# EasyEDA Pro project ProPrj_BL0910+ESP8266十路小体积电能表_2024-10-20_14-27-09_2024-11-02.epro

# Schematic BL0910+ESP8266十路小体积电能表
Board Name: BL0910+ESP8266十路小体积电能表; Create Date: 2024-10-20; Page Name: Sheet_1; Project Name: BL0910+ESP8266十路小体积电能表_2024-10-20_14-27-09; Schematic Name: BL0910+ESP8266十路小体积电能表; Update Date: 2024-10-31; Add into BOM: yes; Company: Your Company; Convert to PCB: yes; Date: 2024-10-16; Draw By: mxmcxy; REV: 1.0; Sheet: 1/1
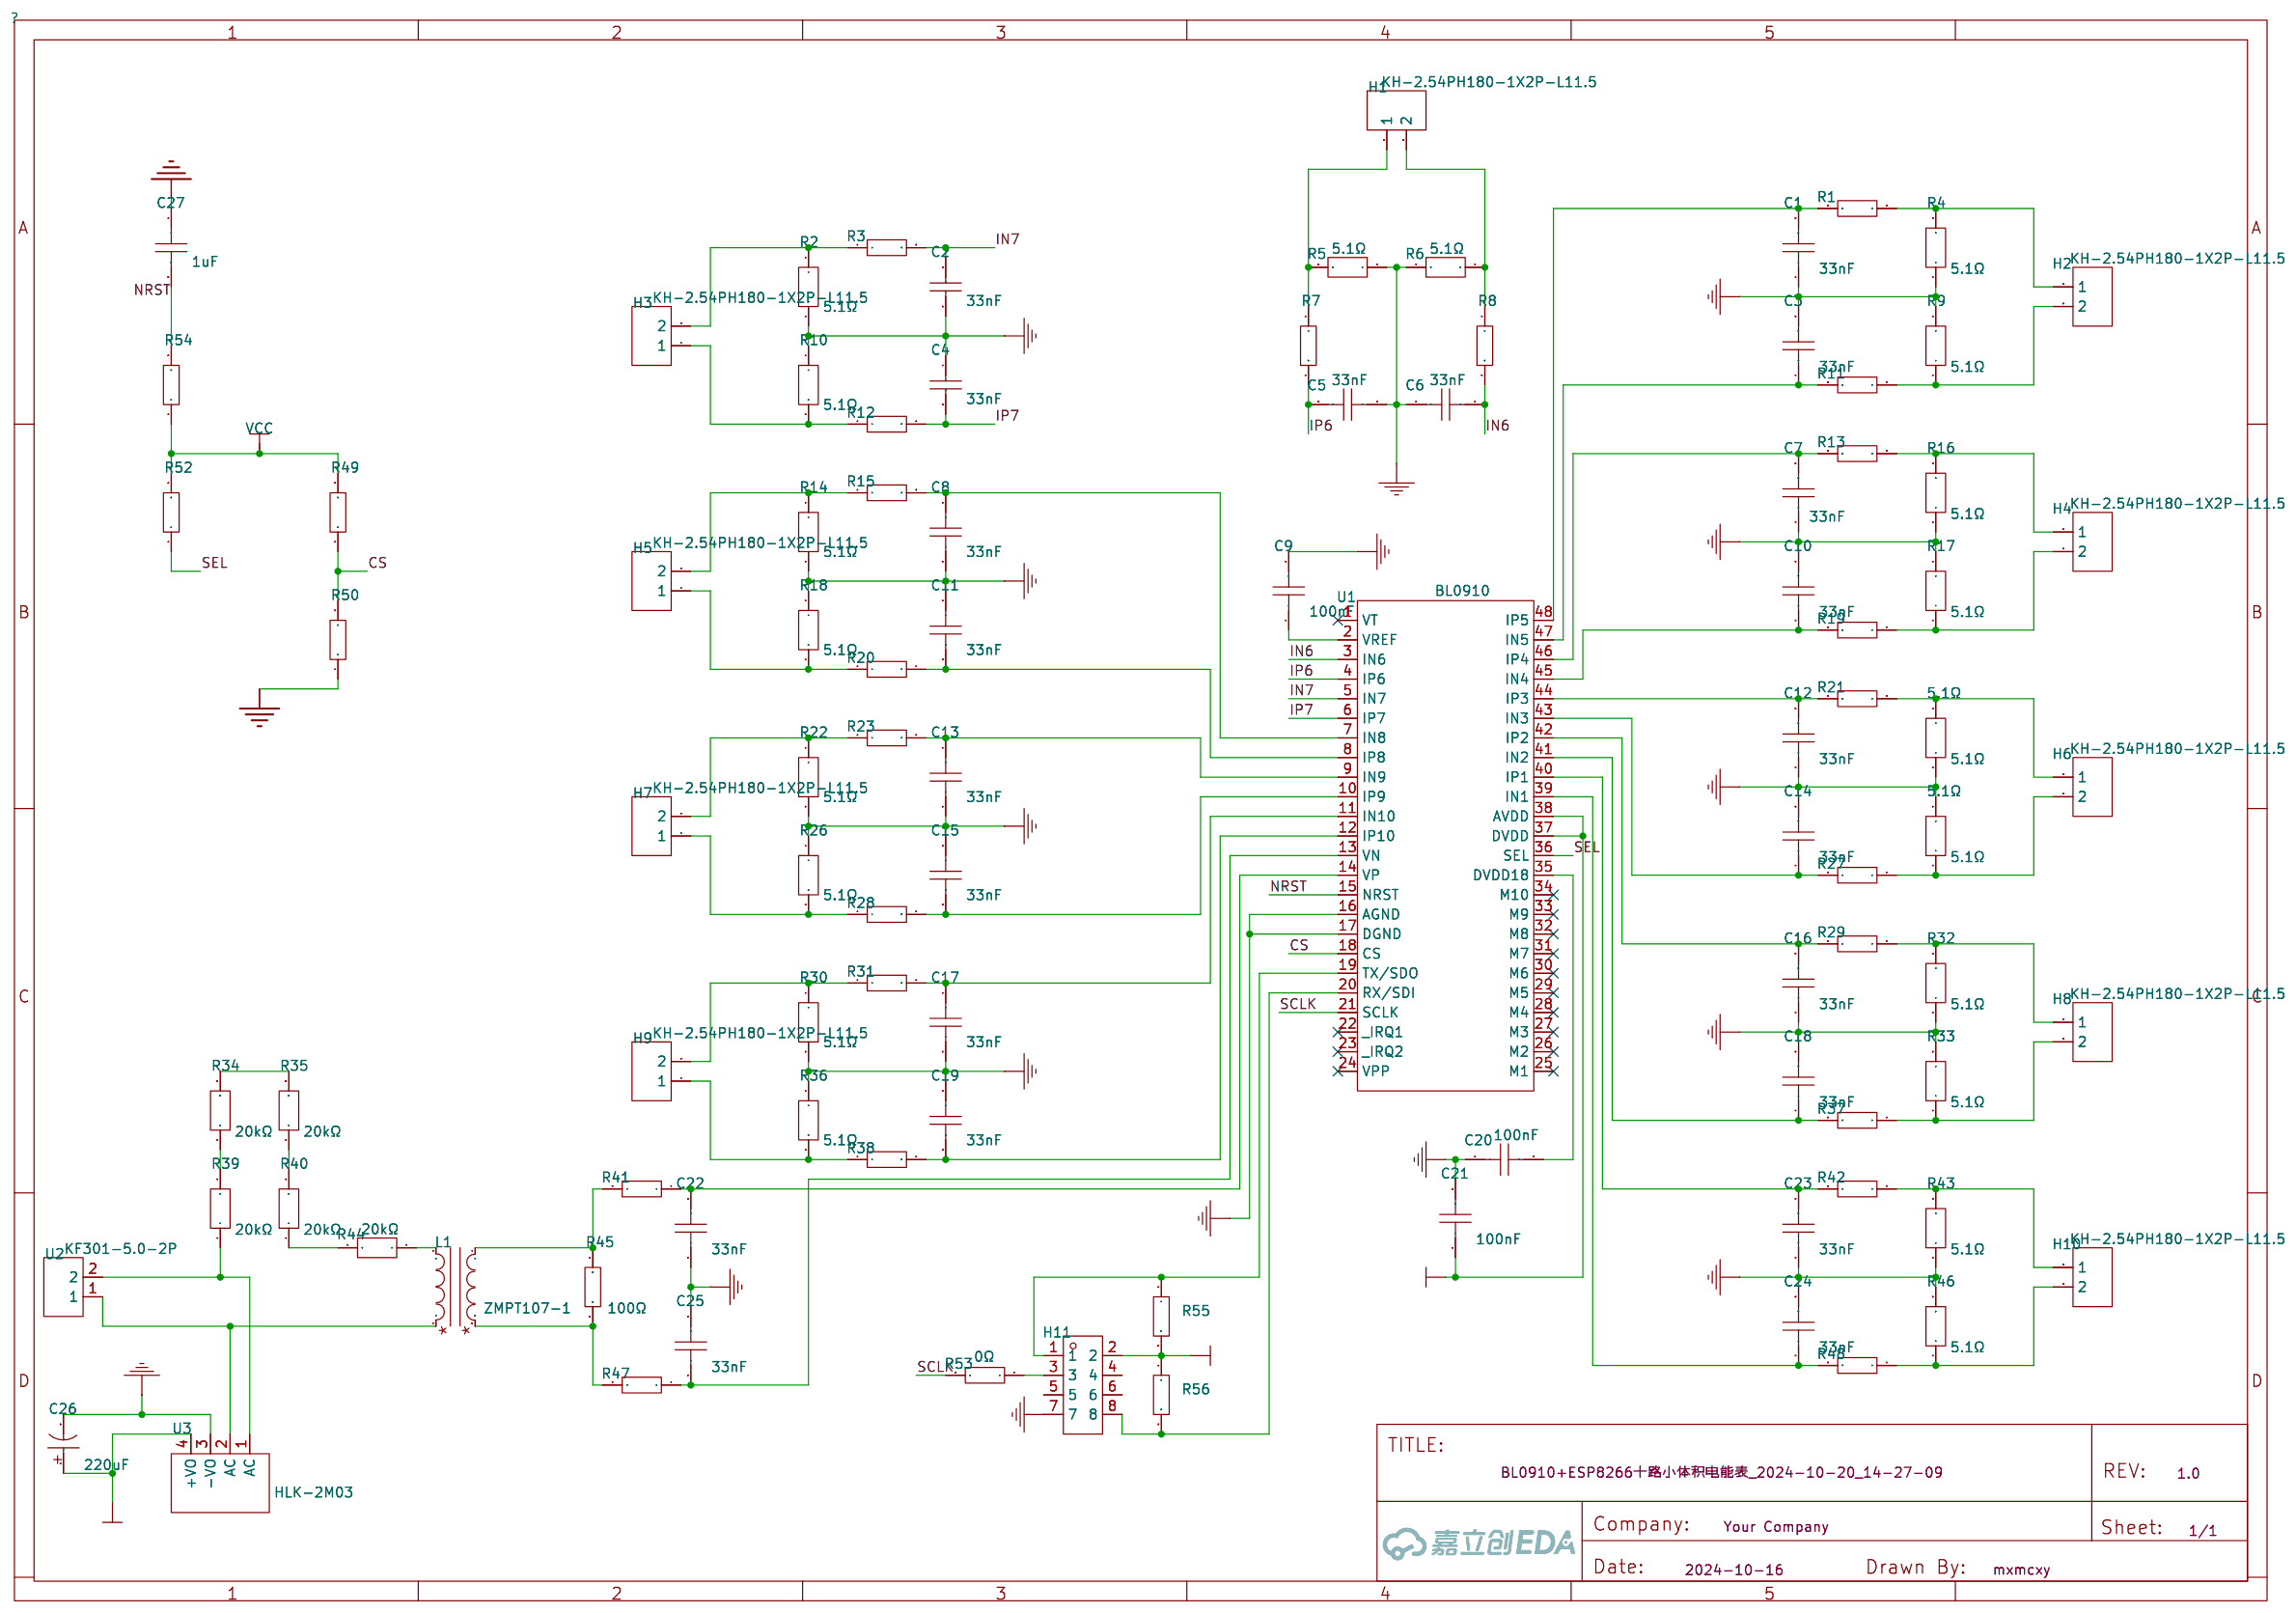
[diagram p0: schematic sheet]

## Parts
5.1Ω  5.1Ω  [R0603]
5.1Ω#2  5.1Ω  [R0603]
C1  33nF  [C0603]
C2  33nF  [C0603]
C3  33nF  [C0603]
C4  33nF  [C0603]
C5  33nF  [C0603]
C6  33nF  [C0603]
C7  33nF  [C0603]
C8  33nF  [C0603]
C9  100nF  [C0603]
C10  33nF  [C0603]
C11  33nF  [C0603]
C12  33nF  [C0603]
C13  33nF  [C0603]
C14  33nF  [C0603]
C15  33nF  [C0603]
C16  33nF  [C0603]
C17  33nF  [C0603]
C18  33nF  [C0603]
C19  33nF  [C0603]
C20  100nF  [C0603]
C21  100nF  [C0603]
C22  33nF  [C0603]
C23  33nF  [C0603]
C24  33nF  [C0603]
C25  33nF  [C0603]
C26  220uF  [CAP-SMD_BD6.3-L6.6-W6.6-FD]
C27  1uF  [C0603]
H1  KH-2.54PH180-1X2P-L11.5  [HDR-TH_2P-P2.54-V-M]
H2  KH-2.54PH180-1X2P-L11.5  [HDR-TH_2P-P2.54-V-M]
H3  KH-2.54PH180-1X2P-L11.5  [HDR-TH_2P-P2.54-V-M]
H4  KH-2.54PH180-1X2P-L11.5  [HDR-TH_2P-P2.54-V-M]
H5  KH-2.54PH180-1X2P-L11.5  [HDR-TH_2P-P2.54-V-M]
H6  KH-2.54PH180-1X2P-L11.5  [HDR-TH_2P-P2.54-V-M]
H7  KH-2.54PH180-1X2P-L11.5  [HDR-TH_2P-P2.54-V-M]
H8  KH-2.54PH180-1X2P-L11.5  [HDR-TH_2P-P2.54-V-M]
H9  KH-2.54PH180-1X2P-L11.5  [HDR-TH_2P-P2.54-V-M]
H10  KH-2.54PH180-1X2P-L11.5  [HDR-TH_2P-P2.54-V-M]
H11  PM254V-12-08-H85  [HDR-TH_8P-P2.54-V-F-R2-C4-S2.54]
L1  ZMPT107-1  [XFMR-TH_ZMPT107-1]
R1  1kΩ  [R0603]
R2  5.1Ω  [R0603]
R3  1kΩ  [R0603]
R4  5.1Ω  [R0603]
R5  5.1Ω  [R0603]
R6  5.1Ω  [R0603]
R7  1kΩ  [R0603]
R8  1kΩ  [R0603]
R9  5.1Ω  [R0603]
R10  5.1Ω  [R0603]
R11  1kΩ  [R0603]
R12  1kΩ  [R0603]
R13  1kΩ  [R0603]
R14  5.1Ω  [R0603]
R15  1kΩ  [R0603]
R16  5.1Ω  [R0603]
R17  5.1Ω  [R0603]
R18  5.1Ω  [R0603]
R19  1kΩ  [R0603]
R20  1kΩ  [R0603]
R21  1kΩ  [R0603]
R22  5.1Ω  [R0603]
R23  1kΩ  [R0603]
R26  5.1Ω  [R0603]
R27  1kΩ  [R0603]
R28  1kΩ  [R0603]
R29  1kΩ  [R0603]
R30  5.1Ω  [R0603]
R31  1kΩ  [R0603]
R32  5.1Ω  [R0603]
R33  5.1Ω  [R0603]
R34  20kΩ  [R0603]
R35  20kΩ  [R0603]
R36  5.1Ω  [R0603]
R37  1kΩ  [R0603]
R38  1kΩ  [R0603]
R39  20kΩ  [R0603]
R40  20kΩ  [R0603]
R41  1kΩ  [R0603]
R42  1kΩ  [R0603]
R43  5.1Ω  [R0603]
R44  20kΩ  [R0603]
R45  100Ω  [R0603]
R46  5.1Ω  [R0603]
R47  1kΩ  [R0603]
R48  1kΩ  [R0603]
R49  1kΩ  [R0603]
R50  1kΩ  [R0603]
R52  1kΩ  [R0603]
R53  0Ω  [R0603]
R54  1kΩ  [R0603]
R55  1kΩ  [R0603]
R56  1kΩ  [R0603]
U1  BL0910  [LQFP-48_L7.0-W7.0-P0.50-LS9.0-BL]
U2  KF301-5.0-2P  [CONN-TH_P5.00_KF301-5.0-2P]
U3  HLK-2M03  [PWRM-TH_HLK-2M03]

## Library data of the parts
5.1Ω 5.1Ω#2 R2 R4-R6 R9 R10 R14 R16-R18 R22 R26 R30 R32 R33 R36 R43 R46 = TD03G5R10BT: 电阻类型:薄膜电阻;阻值:5.1Ω;精度:±0.1%;功率:100mW;温度系数:±25ppm/℃;; LCSC Part Name: 薄膜电阻 5.1Ω ±0.1% 100mW; Supplier Part: C657209; Manufacturer: FH(风华); Supplier Footprint: 0603; JLCPCB Part Class: Extended Part; Datasheet: https://atta.szlcsc.com/upload/public/pdf/source/20181211/C347100_9EFE94D77969634609276CBD120ED731.pdf; Supplier: LCSC; Type: 薄膜电阻; Tolerance: ±0.1%; Power(Watts): 100mW; Temperature Coefficient: ±25ppm/℃
C1-C8 C10-C19 C22-C25 = CL10B333KB8NNNC: 容值:33nF;精度:±10%;额定电压:50V;材质(温度系数):X7R;; LCSC Part Name: 33nF ±10% 50V; Supplier Part: C21117; Manufacturer: SAMSUNG(三星); Supplier Footprint: 0603; JLCPCB Part Class: Basic Part; Datasheet: https://atta.szlcsc.com/upload/public/pdf/source/20160218/1457707763339.pdf; Supplier: LCSC; Tolerance: ±10%; Voltage Rated: 50V; Temperature Coefficient: X7R
C9 C20 C21 = CGA0603X7R104K500JT: 容值:100nF;精度:±10%;额定电压:50V;材质(温度系数):X7R;; LCSC Part Name: 100nF ±10% 50V; Supplier Part: C6119867; Manufacturer: HRE(芯声); Supplier Footprint: 0603; JLCPCB Part Class: Extended Part; Supplier: LCSC; Tolerance: ±10%; Voltage Rated: 50V; Temperature Coefficient: X7R
C26 = RVT220UF16V67RV0015: 容值:220uF;精度:±20%;额定电压:16V;纹波电流:110mA@120Hz;等效串联电阻:-;; LCSC Part Name: 220uF ±20% 16V; Supplier Part: C2887273; Manufacturer: KNSCHA(科尼盛); Supplier Footprint: SMD,D6.3xL7.7mm; JLCPCB Part Class: Extended Part; Datasheet: https://atta.szlcsc.com/upload/public/pdf/source/20210824/3DC9999D9B098FE241E3A26137981C4C.pdf; Supplier: LCSC; Tolerance: ±20%; Rated Voltage: 16V; Ripple Current: 110mA@120Hz; φD: 6.3mm; L: 7.7mm; Lifetime @ Temp: 2000hrs@105℃; Operating Temperature: -55℃~+105℃
C27 = CGA0603X5R105K160JT: 容值:1uF;精度:±10%;额定电压:16V;材质(温度系数):X5R;; LCSC Part Name: 1uF ±10% 16V; Supplier Part: C6119849; Manufacturer: HRE(芯声); Supplier Footprint: 0603; JLCPCB Part Class: Extended Part; Supplier: LCSC; Tolerance: ±10%; Voltage Rated: 16V; Temperature Coefficient: X5R
H1-H10 = KH-2.54PH180-1X2P-L11.5: 插针结构:1x2P;间距:2.54mm;行距:-;圆针/方针:方针;安装类型:直插;排数:单排;总PIN位数:2P;额定电流:3A;额定电压:-;配合针长度:6mm;塑高:2.5mm;端接针长度:3mm;触头材质:-;工作温度范围:-40℃~+105℃;颜色:黑色;; LCSC Part Name: 间距:2.54mm 1x2P 直插 方针; Supplier Part: C2905434; Manufacturer: kinghelm(金航标); Supplier Footprint: 插件,P=2.54mm; JLCPCB Part Class: Extended Part; Datasheet: https://atta.szlcsc.com/upload/public/pdf/source/20211019/75EAF9E0823F75B5BB441C07BAE9F5E6.pdf; Supplier: LCSC; Pin Structure: 1x2P; Pitch: 2.54mm; Circluar Pins/Square Pins: 方针; Mounting Type: 直插; Number of Rows: 单排; Number of Pins: 2P; Current Rating (Max): 3A; Length of Mating Pin: 6mm; Insulation Height: 2.5mm; Length of End Connection Pin: 3mm; Operating Temperature Range: -40℃~+105℃; Color: 黑色
H11 = PM254V-12-08-H85: 插孔结构:2x4P;间距:2.54mm;行距:2.54mm;圆孔/方孔:方孔;安装类型:直插;排数:双排;总孔位数:8P;额定电流:3A;额定电压:250V;插孔方向:顶部;塑高:8.5mm;工作温度范围:-40℃~+105℃;; LCSC Part Name: 间距:2.54mm 2x4P 直插; Supplier Part: C2834799; Manufacturer: XFCN(兴飞); Supplier Footprint: 插件,P=2.54mm; JLCPCB Part Class: Extended Part; Datasheet: https://atta.szlcsc.com/upload/public/pdf/source/20200309/C492399_8C441E2934FBB604A89B37A68AA45ECF.pdf; Supplier: LCSC; Holes Structure: 2x4P; Pitch: 2.54mm; Row Spacing: 2.54mm; Circular Hole / Square Hole: 方孔; Mounting Type: 直插; Number of Rows: 双排; Number of Holes: 8P; Current Rating (Max): 3A; Voltage Rating (Max): 250V; Holes Direction: 顶部; Insulation Height: 8.5mm; Operating Temperature Range: -40℃~+105℃
L1 = ZMPT107-1_C125191: 类型:电压互感器;匝数比:1:1;额定输入电流:2mA;额定输出电流:2mA;频率范围:-;次级侧电感值:-;; Supplier Part: C125191; Manufacturer: 择明朗熙; Supplier Footprint: 插件; JLCPCB Part Class: Extended Part; Datasheet: https://atta.szlcsc.com/upload/public/pdf/source/20200113/C482589_3E4F38C8012CAB1F8FE7F318F1CE8B25.pdf; Supplier: LCSC; Type: 电压互感器; Current Ratio: 1:1; Current Rating: 2mA; Rated Output Current: 2mA; Linearity: 0.2%
R1 R3 R7 R8 R11-R13 R15 R19-R21 R23 R27-R29 R31 R37 R38 R41 R42 R47-R50 R52 R54-R56 = 0603WAF1001T5E: 电阻类型:厚膜电阻;阻值:1kΩ;精度:±1%;功率:100mW;最大工作电压:75V;温度系数:±100ppm/℃;; LCSC Part Name: 1kΩ ±1% 100mW 厚膜电阻; Supplier Part: C21190; Manufacturer: UNI-ROYAL(厚声); Supplier Footprint: 0603; JLCPCB Part Class: Basic Part; Datasheet: https://atta.szlcsc.com/upload/public/pdf/source/20200306/C422600_1E6D84923E4A46A82E41ADD87F860B5C.pdf; Supplier: LCSC; Type: 厚膜电阻; Tolerance: ±1%; Power(Watts): 100mW; Overload Voltage (Max): 75V; Temperature Coefficient: ±100ppm/℃; Operating Temperature Range: -55℃~+155℃
R34 R35 R39 R40 R44 = RT0603BRD0720KL: 电阻类型:薄膜电阻;阻值:20kΩ;精度:±0.1%;功率:100mW;最大工作电压:75V;温度系数:±25ppm/℃;; LCSC Part Name: 薄膜电阻 20kΩ ±0.1% 100mW; Supplier Part: C723637; Manufacturer: YAGEO(国巨); Supplier Footprint: 0603; JLCPCB Part Class: Extended Part; Datasheet: https://atta.szlcsc.com/upload/public/pdf/source/20200814/C723637_57E5E8B3C02F5D5BA42E401EB3E82C8B.pdf; Supplier: LCSC; Type: 薄膜电阻; Tolerance: ±0.1%; Power(Watts): 100mW; Overload Voltage (Max): 75V; Temperature Coefficient: ±25ppm/℃; Operating Temperature Range: -55℃~+155℃
R45 = RT0603BRD07100RL: 电阻类型:薄膜电阻;阻值:100Ω;精度:±0.1%;功率:100mW;最大工作电压:75V;温度系数:±25ppm/℃;; LCSC Part Name: 薄膜电阻 100Ω ±0.1% 100mW; Supplier Part: C122970; Manufacturer: YAGEO(国巨); Supplier Footprint: 0603; JLCPCB Part Class: Extended Part; Datasheet: https://atta.szlcsc.com/upload/public/pdf/source/20180716/C95646_694A11296E8D6C27B0592E54BC4097D1.pdf; Supplier: LCSC; Type: 薄膜电阻; Tolerance: ±0.1%; Power(Watts): 100mW; Overload Voltage (Max): 75V; Temperature Coefficient: ±25ppm/℃; Operating Temperature Range: -55℃~+155℃
R53 = 0603WAF0000T5E: 电阻类型:厚膜电阻;阻值:0Ω;精度:±1%;功率:100mW;最大工作电压:75V;; LCSC Part Name: 0Ω ±1% 100mW 厚膜电阻; Supplier Part: C21189; Manufacturer: UNI-ROYAL(厚声); Supplier Footprint: 0603; JLCPCB Part Class: Basic Part; Datasheet: https://atta.szlcsc.com/upload/public/pdf/source/20200306/C422600_1E6D84923E4A46A82E41ADD87F860B5C.pdf; Supplier: LCSC; Type: 厚膜电阻; Tolerance: ±1%; Power(Watts): 100mW; Overload Voltage (Max): 75V; Operating Temperature Range: -55℃~+155℃
U1 = BL0910: Supplier Part: C2841006; Manufacturer: BL(上海贝岭); Supplier Footprint: LQFP-48(7x7); JLCPCB Part Class: Extended Part; Datasheet: https://atta.szlcsc.com/upload/public/pdf/source/20210624/C2841006_35AA07738A81D644F73A53BBC0288862.pdf; Supplier: LCSC
U2 = KF301-5.0-2P: 结构:1x2P;间距:5mm;颜色:蓝色;安装方式:直插;额定电流:17A;额定电压:250V;排数:1;线规 - AWG:14~22;线规 - 平方毫米:1.5;每排PIN数:2;工作温度范围:-30℃~+120℃;; LCSC Part Name: 5mm 1x2P 排数:1 每排P数:2 直插; Supplier Part: C474881; Manufacturer: KEFA(科发); Supplier Footprint: 插件,P=5mm; JLCPCB Part Class: Extended Part; Datasheet: https://atta.szlcsc.com/upload/public/pdf/source/20230317/03A5B5FC229D6F9225E8F51DA1A4E80A.pdf; Supplier: LCSC; Structure: 1x2P; Pitch: 5mm; Color: 蓝色; Mounting Style: 直插; Current Rating (Max): 17A; Voltage Rating (Max): 250V; Number of Pins: 2P; Number of Rows: 1; Wire Gauge - AWG: 14~22; Wire Gauge - mm2: 1.5; Number of PINs Per Row: 2; Operating Temperature Range: -30℃~+120℃
U3 = HLK-2M03: Supplier Part: C399249; Manufacturer: HI-LINK(海凌科); Supplier Footprint: 插件; JLCPCB Part Class: Extended Part; Datasheet: https://atta.szlcsc.com/upload/public/pdf/source/20211130/BB6CF3554B3927EB762928BD287CEFEE.pdf; Supplier: LCSC

## Nets
GND: 5.1Ω.2 5.1Ω#2.1 C1.1 C2.2 C3.2 C4.1 C5.1 C6.2 C7.1 C8.2 C9.2 C10.2 C11.1 C12.1 C13.2 C14.2 C15.1 C16.1 C17.2 C18.2 C19.1 C20.1 C21.2 C22.1 C23.1 C24.2 C25.2 C26.2 C27.1 H11.7 R2.2 R4.1 R5.1 R6.2 R9.2 R10.1 R14.2 R16.1 R17.2 R18.1 R22.2 R26.1 R30.2 R32.1 R33.2 R36.1 R43.1 R46.2 R50.1 U1.16(AGND) U1.17(DGND) U3.3(-VO)
VCC: C21.1 C26.1 H11.2 R49.2 R52.2 R54.1 R55.2 R56.1 U1.37(DVDD) U1.38(AVDD) U3.4(+VO)
CS: R49.1 R50.2 U1.18(CS)
IN6: C6.1 R8.2 U1.3(IN6)
IN7: C2.1 R3.2 U1.5(IN7)
IP6: C5.2 R7.2 U1.4(IP6)
IP7: C4.2 R12.2 U1.6(IP7)
NRST: C27.2 R54.2 U1.15(NRST)
SCLK: R53.2 U1.21(SCLK)
SEL: R52.1 U1.36(SEL)
$C1_2: C1.2 R1.2 U1.48(IP5)
$C3_1: C3.1 R11.2 U1.47(IN5)
$C7_2: C7.2 R13.2 U1.46(IP4)
$C8_1: C8.1 R15.2 U1.7(IN8)
$C9_1: C9.1 U1.2(VREF)
$C10_1: C10.1 R19.2 U1.45(IN4)
$C11_2: C11.2 R20.2 U1.8(IP8)
$C12_2: C12.2 R21.2 U1.44(IP3)
$C13_1: C13.1 R23.2 U1.9(IN9)
$C14_1: C14.1 R27.2 U1.43(IN3)
$C15_2: C15.2 R28.2 U1.10(IP9)
$C16_2: C16.2 R29.2 U1.42(IP2)
$C17_1: C17.1 R31.2 U1.11(IN10)
$C18_1: C18.1 R37.2 U1.41(IN2)
$C19_2: C19.2 R38.2 U1.12(IP10)
$C20_2: C20.2 U1.35(DVDD18)
$C22_2: C22.2 R41.1 U1.14(VP)
$C23_2: C23.2 R42.2 U1.40(IP1)
$C24_1: C24.1 R48.2 U1.39(IN1)
$C25_1: C25.1 R47.1 U1.13(VN)
$H1_1: H1.1 R5.2 R7.1
$H1_2: H1.2 R6.1 R8.1
$H2_1: H2.1 R1.1 R4.2
$H2_2: H2.2 R9.1 R11.1
$H3_1: H3.1 R10.2 R12.1
$H3_2: H3.2 R2.1 R3.1
$H4_1: H4.1 R13.1 R16.2
$H4_2: H4.2 R17.1 R19.1
$H5_1: H5.1 R18.2 R20.1
$H5_2: H5.2 R14.1 R15.1
$H7_1: H7.1 R26.2 R28.1
$H7_2: H7.2 R22.1 R23.1
$H8_1: H8.1 R29.1 R32.2
$H8_2: H8.2 R33.1 R37.1
$H9_1: H9.1 R36.2 R38.1
$H9_2: H9.2 R30.1 R31.1
$H10_1: H10.1 R42.1 R43.2
$H10_2: H10.2 R46.1 R48.1
$H11_1: H11.1 R55.1 U1.19(TX/SDO)
$H11_3: H11.3 R53.1
$H11_8: H11.8 R56.2 U1.20(RX/SDI)
$L1_1: L1.1 U2.1 U3.2(AC)
$L1_2: L1.2 R44.1
$L1_3: L1.3 R45.2 R47.2
$L1_4: L1.4 R41.2 R45.1
$R34_1: R34.1 R39.2
$R34_2: R34.2 R35.2
$R35_1: R35.1 R40.2
$R39_1: R39.1 U2.2 U3.1(AC)
$R40_1: R40.1 R44.2
Net-(5.1Ω#2-2): 5.1Ω#2.2 H6.1 R21.1
Net-(5.1Ω-1): 5.1Ω.1 H6.2 R27.1

Not connected (* = marked no-connect by the designer): H11 4 5 6; U1 1(VT)* 22(_IRQ1)* 23(_IRQ2)* 24(VPP)* 25(M1)* 26(M2)* 27(M3)* 28(M4)* 29(M5)* 30(M6)* 31(M7)* 32(M8)* 33(M9)* 34(M10)*

# Board 反面负载
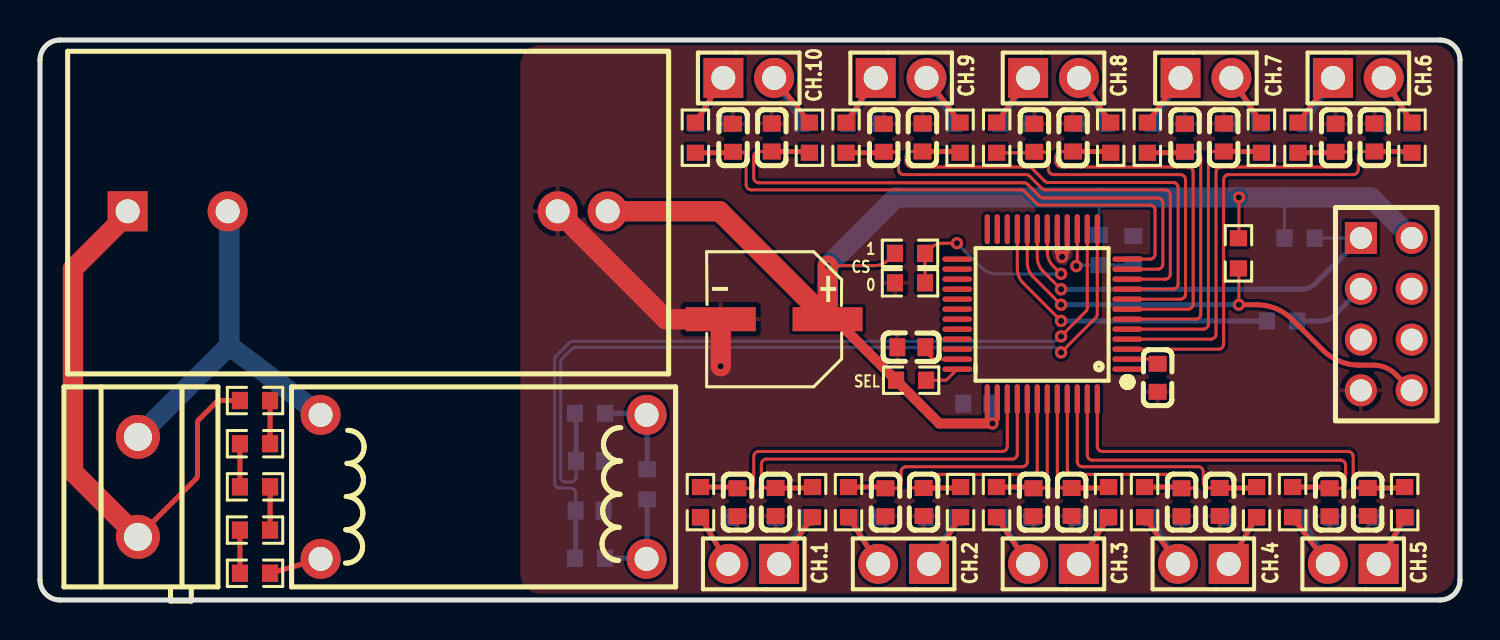
[diagram p1: board, top side]
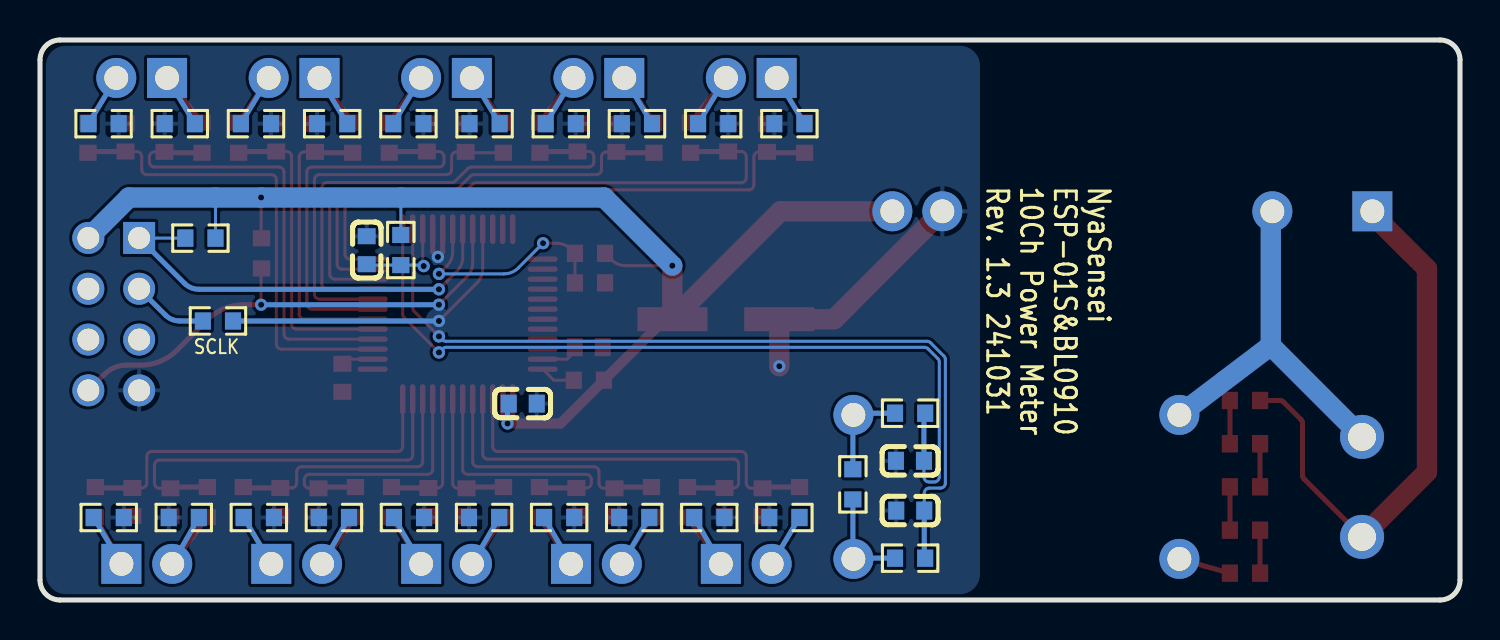
[diagram p2: board, bottom side, seen from below]

Outline 71 x 28 mm; copper layers: Top Layer, Bottom Layer. Coordinates in mm from the lower left corner of the outline.
Outline path: 0,27 0,1 arc(0.29,0.29) 1,0 70,0 arc(70.71,0.29) 71,1 71,27 arc(70.71,27.71) 70,28 1,28 arc(0.29,27.71) 0,27
Stack: Top Layer 0.035mm / Dielectric1 1.51mm FR4 er 4.5 / Bottom Layer 0.035mm

## Design rules (mm)
spacing Default (default): track to track 0.152, other pairs 0 to 0.152
track width Default (default): min 0.152, default 0.152, max 25.4
differential pair differentialPair (default): width min 0.127, default 0.254, max 2.54; gap min 0.152, default 0.152
via Default (default): diameter min 0.61, default 0.61, max 100.025; hole min 0.305, default 0.305, max 59.995

## Placement (name value [footprint] x y rotation side)
5.1Ω  5.1Ω  [R0603]  52.55 4.12 0 bottom
5.1Ω#2  5.1Ω  [R0603]  48.8 4.12 0 bottom
C1  33nF  [C0603]  66.39 4.9 90 top
C2  33nF  [C0603]  59.19 23.12 90 top
C3  33nF  [C0603]  64.48 4.89 270 top
C4  33nF  [C0603]  57.25 23.11 270 top
C5  33nF  [C0603]  64.78 23.11 270 top
C6  33nF  [C0603]  66.72 23.12 90 top
C7  33nF  [C0603]  58.98 4.9 90 top
C8  33nF  [C0603]  51.66 23.12 90 top
C9  100nF  [C0603]  55.88 11.11 270 top
C10  33nF  [C0603]  57.08 4.89 270 top
C11  33nF  [C0603]  49.71 23.11 270 top
C12  33nF  [C0603]  51.58 4.9 90 top
C13  33nF  [C0603]  44.12 23.12 90 top
C14  33nF  [C0603]  49.67 4.89 270 top
C15  33nF  [C0603]  42.18 23.11 270 top
C16  33nF  [C0603]  44.18 4.9 90 top
C17  33nF  [C0603]  36.59 23.12 90 top
C18  33nF  [C0603]  42.27 4.89 270 top
C19  33nF  [C0603]  34.65 23.11 270 top
C20  100nF  [C0603]  43.56 12.64 0 top
C21  100nF  [C0603]  46.86 9.82 180 bottom
C22  33nF  [C0603]  27.49 4.47 180 bottom
C23  33nF  [C0603]  36.78 4.9 90 top
C24  33nF  [C0603]  34.87 4.89 270 top
C25  33nF  [C0603]  27.5 6.96 0 bottom
C26  220uF  [CAP-SMD_BD6.3-L6.6-W6.6-FD]  36.71 14.04 180 top
C27  1uF  [C0603]  54.66 17.49 270 bottom
H1  KH-2.54PH180-1X2P-L11.5  [HDR-TH_2P-P2.54-V-M]  65.92 26.1 0 top
H2  KH-2.54PH180-1X2P-L11.5  [HDR-TH_2P-P2.54-V-M]  65.66 1.81 180 top
H3  KH-2.54PH180-1X2P-L11.5  [HDR-TH_2P-P2.54-V-M]  58.3 26.1 0 top
H4  KH-2.54PH180-1X2P-L11.5  [HDR-TH_2P-P2.54-V-M]  58.17 1.81 180 top
H5  KH-2.54PH180-1X2P-L11.5  [HDR-TH_2P-P2.54-V-M]  50.68 26.1 0 top
H6  KH-2.54PH180-1X2P-L11.5  [HDR-TH_2P-P2.54-V-M]  50.67 1.81 180 top
H7  KH-2.54PH180-1X2P-L11.5  [HDR-TH_2P-P2.54-V-M]  43.06 26.1 0 top
H8  KH-2.54PH180-1X2P-L11.5  [HDR-TH_2P-P2.54-V-M]  43.18 1.81 180 top
H9  KH-2.54PH180-1X2P-L11.5  [HDR-TH_2P-P2.54-V-M]  35.44 26.1 0 top
H10  KH-2.54PH180-1X2P-L11.5  [HDR-TH_2P-P2.54-V-M]  35.69 1.81 180 top
H11  PM254V-12-08-H85  [HDR-TH_8P-P2.54-V-F-R2-C4-S2.54]  67.31 14.29 270 top
L1  ZMPT107-1  [XFMR-TH_ZMPT107-1]  22.18 5.66 0 top
R1  1kΩ  [R0603]  68.23 4.89 90 top
R2  5.1Ω  [R0603]  60.2 23.82 180 bottom
R3  1kΩ  [R0603]  61.07 23.12 270 top
R4  5.1Ω  [R0603]  67.56 4.12 0 bottom
R5  5.1Ω  [R0603]  64.01 23.82 180 bottom
R6  5.1Ω  [R0603]  67.82 23.82 180 bottom
R7  1kΩ  [R0603]  62.9 23.12 270 top
R8  1kΩ  [R0603]  68.6 23.12 270 top
R9  5.1Ω  [R0603]  63.81 4.12 0 bottom
R10  5.1Ω  [R0603]  56.39 23.82 180 bottom
R11  1kΩ  [R0603]  62.63 4.89 90 top
R12  1kΩ  [R0603]  55.37 23.12 270 top
R13  1kΩ  [R0603]  60.83 4.89 90 top
R14  5.1Ω  [R0603]  52.58 23.82 180 bottom
R15  1kΩ  [R0603]  53.54 23.12 270 top
R16  5.1Ω  [R0603]  60.06 4.12 0 bottom
R17  5.1Ω  [R0603]  56.3 4.12 0 bottom
R18  5.1Ω  [R0603]  48.77 23.82 180 bottom
R19  1kΩ  [R0603]  55.23 4.89 90 top
R20  1kΩ  [R0603]  47.83 23.12 270 top
R21  1kΩ  [R0603]  53.43 4.89 90 top
R22  5.1Ω  [R0603]  44.96 23.82 180 bottom
R23  1kΩ  [R0603]  46 23.12 270 top
R26  5.1Ω  [R0603]  41.15 23.82 180 bottom
R27  1kΩ  [R0603]  47.83 4.89 90 top
R28  1kΩ  [R0603]  40.3 23.12 270 top
R29  1kΩ  [R0603]  46.03 4.89 90 top
R30  5.1Ω  [R0603]  37.34 23.82 180 bottom
R31  1kΩ  [R0603]  38.47 23.12 270 top
R32  5.1Ω  [R0603]  45.04 4.12 0 bottom
R33  5.1Ω  [R0603]  41.29 4.12 0 bottom
R34  20kΩ  [R0603]  10.75 7.81 180 top
R35  20kΩ  [R0603]  10.75 5.66 180 top
R36  5.1Ω  [R0603]  33.53 23.82 180 bottom
R37  1kΩ  [R0603]  40.43 4.89 90 top
R38  1kΩ  [R0603]  32.77 23.12 270 top
R39  20kΩ  [R0603]  10.75 9.97 0 top
R40  20kΩ  [R0603]  10.75 3.5 0 top
R41  1kΩ  [R0603]  27.5 2.09 0 bottom
R42  1kΩ  [R0603]  38.63 4.89 90 top
R43  5.1Ω  [R0603]  37.54 4.12 0 bottom
R44  20kΩ  [R0603]  10.75 1.34 180 top
R45  100Ω  [R0603]  30.36 5.78 90 bottom
R46  5.1Ω  [R0603]  33.78 4.12 0 bottom
R47  1kΩ  [R0603]  27.5 9.34 0 bottom
R48  1kΩ  [R0603]  33.02 4.89 90 top
R49  1kΩ  [R0603]  43.5 17.33 180 top
R50  1kΩ  [R0603]  43.5 15.86 0 top
R52  1kΩ  [R0603]  43.56 10.99 180 top
R53  0Ω  [R0603]  62.1 13.95 180 bottom
R54  1kΩ  [R0603]  52.96 17.5 270 bottom
R55  1kΩ  [R0603]  62.98 18.09 180 bottom
R56  1kΩ  [R0603]  59.92 17.33 270 top
U1  BL0910  [LQFP-48_L7.0-W7.0-P0.50-LS9.0-BL]  50.12 14.29 90 top
U2  KF301-5.0-2P  [CONN-TH_P5.00_KF301-5.0-2P]  4.9 5.66 270 top
U3  HLK-2M03  [PWRM-TH_HLK-2M03]  16.38 19.43 0 top

## Footprints (pads in the part's own frame, mm; a bottom-side part is the same pattern mirrored in y, then rotated)
C0603
  rect 0.8x0.9 smd: 1(-0.7,0) 2(0.7,0)
CAP-SMD_BD6.3-L6.6-W6.6-FD
  rect 3.5x1.2 smd: 1(-2.67,0) 2(2.67,0)
CONN-TH_P5.00_KF301-5.0-2P
  round 2.2 hole 1.4: 1(-2.5,0) 2(2.5,0)
HDR-TH_2P-P2.54-V-M
  rect 2x2 hole 1.2: 1(-1.27,0)
  round 2 hole 1.2: 2(1.27,0)
HDR-TH_8P-P2.54-V-F-R2-C4-S2.54
  rect 1.6x1.6 hole 1.1: 1(-3.81,-1.27)
  round 1.6 hole 1.1: 2(-3.81,1.27) 3(-1.27,-1.27) 4(-1.27,1.27) 5(1.27,-1.27) 6(1.27,1.27) 7(3.81,-1.27) 8(3.81,1.27)
LQFP-48_L7.0-W7.0-P0.50-LS9.0-BL
  oval 0.27x1.5 smd: 1(-2.75,-4.25) 2(-2.25,-4.25) 3(-1.75,-4.25) 4(-1.25,-4.25) 5(-0.75,-4.25) 6(-0.25,-4.25) 7(0.25,-4.25) 8(0.75,-4.25) 9(1.25,-4.25) 10(1.75,-4.25) 11(2.25,-4.25) 12(2.75,-4.25) 25(2.75,4.25) 26(2.25,4.25) 27(1.75,4.25) 28(1.25,4.25) 29(0.75,4.25) 30(0.25,4.25) 31(-0.25,4.25) 32(-0.75,4.25) 33(-1.25,4.25) 34(-1.75,4.25) 35(-2.25,4.25) 36(-2.75,4.25)
  oval 1.5x0.27 smd: 13(4.25,-2.75) 14(4.25,-2.25) 15(4.25,-1.75) 16(4.25,-1.25) 17(4.25,-0.75) 18(4.25,-0.25) 19(4.25,0.25) 20(4.25,0.75) 21(4.25,1.25) 22(4.25,1.75) 23(4.25,2.25) 24(4.25,2.75) 37(-4.25,2.75) 38(-4.25,2.25) 39(-4.25,1.75) 40(-4.25,1.25) 41(-4.25,0.75) 42(-4.25,0.25) 43(-4.25,-0.25) 44(-4.25,-0.75) 45(-4.25,-1.25) 46(-4.25,-1.75) 47(-4.25,-2.25) 48(-4.25,-2.75)
PWRM-TH_HLK-2M03
  rect 2x2 hole 1.2: 1(-12,0)
  round 2 hole 1.2: 2(-7,0) 3(9.5,0) 4(12,0)
R0603
  rect 0.806x0.864 smd: 1(-0.753,0) 2(0.753,0)
XFMR-TH_ZMPT107-1
  round 2 hole 1.2: 1(-8.15,3.6) 2(-8.15,-3.6) 3(8.15,3.6) 4(8.15,-3.6)

## Nets
As in the schematic, except:
GND: 5.1Ω.1 5.1Ω#2.2 C1.1 C2.2 C3.2 C4.1 C5.1 C6.2 C7.1 C8.2 C9.2 C10.2 C11.1 C12.1 C13.2 C14.2 C15.1 C16.1 C17.2 C18.2 C19.1 C20.1 C21.2 C22.1 C23.1 C24.2 C25.2 C26.2 C27.1 H11.7 R2.2 R4.1 R5.1 R6.2 R9.2 R10.1 R14.2 R16.1 R17.2 R18.1 R22.2 R26.1 R30.2 R32.1 R33.2 R36.1 R43.1 R46.2 R50.1 U1.16 U1.17 U3.3
$H6_1: 5.1Ω.2 H6.1 R21.1
$H6_2: 5.1Ω#2.1 H6.2 R27.1

Pads without a net: H11 4 5 6; U1 1 22 23 24 25 26 27 28 29 30 31 32 33 34

## Via types
v1: diameter 0.62, hole 0.31, Top Layer to Bottom Layer, 8 vias
v2: diameter 0.61, hole 0.305, Top Layer to Bottom Layer, 6 vias

## Routing (per net, layer and track width the routed paths; a pad name or vN(x,y) marks a point on that pad's centre or on a via; arc(x,y) is an arc through that point)
GND: length 15.6
  Top Layer w0.254: 51.37,18.54 51.37,17.41 v1(51.1,17.15) 50.87,17.39 U1.17
  Top Layer w1.016: 25.96,19.37 31.29,14.04 C26.2 v2(34.04,11.69)
VCC: length 71.1
  Top Layer w0.152: R49.2 42.43,17.01 arc(42.1,16.79) 41.71,16.72 v2(39.38,16.72) ; 59.92,17.96 59.95,17.98 v2(59.95,20.13)
  Top Layer w0.254: U1.38 47.87,9.06 v2(47.62,8.82) 47.37,9.08 47.37,10.04
  Top Layer w0.508: C26.1 39.76,14.04 R52.2 44.97,8.82 v2(47.62,8.82)
  Top Layer w1.016: U3.4 33.98,19.43 C26.1 39.38,14.05 v2(39.38,16.72)
  Bottom Layer w0.152: R54.1 52.96,20.12 52.95,20.13 ; R55.2 62.23,20.12 62.23,20.13
  Bottom Layer w0.254: v2(47.62,8.82) 47.62,9.76 C21.1
  Bottom Layer w1.016: v2(39.38,16.72) 42.79,20.13 v2(59.95,20.13) 66.55,20.13 68.58,18.1 H11.2
$C1_2: length 19.5
  Top Layer w0.152: 52.87,10.04 52.87,7.68 arc(52.94,7.5) 53.12,7.43 65.41,7.43 arc(65.58,7.35) 65.66,7.17 65.66,5.86 arc(65.73,5.68) 65.91,5.6 C1.2
  Top Layer w0.254: 66.38,5.6 68.19,5.6 68.23,5.65
$C3_1: length 19.7
  Top Layer w0.152: 64.48,5.59 65.02,5.59 arc(65.2,5.66) 65.28,5.84 65.28,6.74 arc(65.2,6.92) 65.02,6.99 52.62,6.99 arc(52.44,7.07) 52.36,7.25 52.36,10.04
  Top Layer w0.254: 62.63,5.65 64.15,5.65 64.21,5.59 C3.1
$C7_2: length 13.1
  Top Layer w0.152: C7.2 58.42,5.6 arc(58.24,5.68) 58.17,5.86 58.17,6.41 arc(58.09,6.59) 57.91,6.66 52.12,6.66 arc(51.94,6.74) 51.86,6.92 51.86,10.04
  Top Layer w0.254: 60.83,5.65 60.79,5.6 C7.2
$C8_1: length 20.4
  Top Layer w0.152: 54.37,14.54 57.4,14.54 arc(57.58,14.61) 57.66,14.79 57.66,21.4 arc(57.58,21.58) 57.4,21.65 51.05,21.65 arc(50.87,21.72) 50.8,21.9 50.8,22.17 arc(50.87,22.35) 51.05,22.42 51.66,22.42
  Top Layer w0.254: 53.54,22.36 53.47,22.42 C8.1
$C9_1: length 1.6
  Top Layer w0.152: 54.37,12.04 55.65,12.04 C9.1
$C10_1: length 13.1
  Top Layer w0.152: 57.08,5.59 57.53,5.59 arc(57.71,5.66) 57.78,5.84 57.78,6.03 arc(57.71,6.21) 57.53,6.28 51.62,6.28 arc(51.44,6.36) 51.37,6.54 U1.45
  Top Layer w0.254: C10.1 56.81,5.59 56.75,5.65 55.23,5.65
$C11_2: length 19.4
  Top Layer w0.152: 49.86,22.36 47.83,22.36 ; 54.37,15.04 57.02,15.04 arc(57.2,15.12) 57.28,15.3 57.28,21.02 arc(57.2,21.19) 57.02,21.27 50.67,21.27 arc(50.49,21.34) 50.42,21.52 50.42,22.15 arc(50.34,22.33) 50.16,22.41 49.72,22.41
$C12_2: length 6.9
  Top Layer w0.152: C12.2 51.12,5.6 arc(50.94,5.68) 50.87,5.86 U1.44
  Top Layer w0.254: 53.43,5.65 53.38,5.6 C12.2
$C13_1: length 24.8
  Top Layer w0.152: 44.12,22.42 43.56,22.42 arc(43.38,22.35) 43.31,22.17 43.31,21.9 arc(43.38,21.72) 43.56,21.65 49.42,21.65 arc(49.52,21.63) 49.6,21.58 50.23,20.95 arc(50.31,20.89) 50.41,20.88 56.65,20.88 arc(56.83,20.8) 56.91,20.62 56.91,15.8 arc(56.83,15.62) 56.65,15.54 U1.9
  Top Layer w0.254: 46,22.36 45.94,22.42 C13.1
$C14_1: length 6.9
  Top Layer w0.152: U1.43 50.37,5.84 arc(50.29,5.66) 50.11,5.59 49.67,5.59
  Top Layer w0.254: 47.83,5.65 49.35,5.65 49.41,5.59 C14.1
$C15_2: length 23.8
  Top Layer w0.152: U1.10 56.26,16.04 arc(56.44,16.12) 56.51,16.3 56.51,20.25 arc(56.44,20.43) 56.26,20.51 50.27,20.51 arc(50.17,20.53) 50.09,20.58 49.48,21.19 arc(49.4,21.25) 49.3,21.27 43.18,21.27 arc(43,21.34) 42.93,21.52 42.93,22.15 arc(42.85,22.33) 42.67,22.41 C15.2
  Top Layer w0.254: 40.3,22.36 42.14,22.36 C15.2
$C16_2: length 13.2
  Top Layer w0.152: U1.42 49.87,6.54 arc(49.79,6.36) 49.61,6.28 43.69,6.28 arc(43.51,6.21) 43.43,6.03 43.43,5.86 arc(43.51,5.68) 43.69,5.6 C16.2
  Top Layer w0.254: C16.2 45.98,5.6 R29.2
$C17_1: length 30
  Top Layer w0.152: U1.11 55.89,16.54 arc(56.07,16.62) 56.14,16.8 56.14,19.84 arc(56.07,20.02) 55.89,20.1 50.17,20.1 arc(50.07,20.12) 49.99,20.17 49.38,20.79 arc(49.3,20.84) 49.2,20.86 35.94,20.86 arc(35.76,20.93) 35.69,21.11 35.69,22.17 arc(35.76,22.35) 35.94,22.42 36.59,22.42
  Top Layer w0.254: 38.47,22.36 38.41,22.42 36.59,22.42
$C18_1: length 13.1
  Top Layer w0.152: 42.27,5.59 42.8,5.59 arc(42.98,5.66) 43.05,5.84 43.05,6.41 arc(43.13,6.59) 43.31,6.66 49.11,6.66 arc(49.29,6.74) 49.37,6.92 49.37,10.04
  Top Layer w0.254: 40.42,5.65 41.95,5.65 42.01,5.59 C18.1
$C19_2: length 28.8
  Top Layer w0.152: U1.12 55.5,17.04 arc(55.68,17.12) 55.75,17.3 55.75,19.49 arc(55.68,19.67) 55.5,19.75 50.02,19.75 arc(49.92,19.76) 49.84,19.82 49.22,20.43 arc(49.14,20.49) 49.04,20.51 35.56,20.51 arc(35.38,20.58) 35.31,20.76 35.31,22.15 arc(35.23,22.33) 35.05,22.41 C19.2
  Top Layer w0.254: C19.2 34.6,22.36 32.77,22.36
$C20_2: length 2
  Top Layer w0.152: U1.35 44.64,12.04 44.12,12.57
$C22_2: length 42.5
  Top Layer w0.152: v1(51.05,13.18) 51.05,13.19 52.29,14.43 arc(52.35,14.51) 52.37,14.61 52.37,18.54
  Bottom Layer w0.152: C22.2 26.79,5.34 arc(26.71,5.52) 26.53,5.6 25.98,5.6 arc(25.81,5.67) 25.73,5.85 25.73,12.02 arc(25.75,12.12) 25.81,12.2 26.47,12.86 arc(26.55,12.92) 26.65,12.94 50.71,12.94 arc(50.8,12.96) 50.89,13.01 v1(51.05,13.18)
  Bottom Layer w0.254: C22.2 26.79,2.14 R41.1
$C23_2: length 19.5
  Top Layer w0.152: 48.86,10.04 48.86,7.3 arc(48.79,7.12) 48.61,7.05 36.32,7.05 arc(36.14,6.97) 36.07,6.79 36.07,5.86 arc(36.14,5.68) 36.32,5.6 C23.2
  Top Layer w0.254: C23.2 38.58,5.6 38.63,5.65
$C24_1: length 19.5
  Top Layer w0.152: 48.36,10.04 48.36,7.68 arc(48.29,7.5) 48.11,7.43 35.94,7.43 arc(35.76,7.35) 35.69,7.17 35.69,5.84 arc(35.61,5.66) 35.43,5.59 34.87,5.59
  Top Layer w0.254: 33.02,5.65 34.55,5.65 34.61,5.59 C24.1
$C25_1: length 42.4
  Top Layer w0.152: v1(51.05,12.38) 52.79,14.12 arc(52.85,14.2) 52.87,14.3 U1.13
  Bottom Layer w0.152: v1(51.05,12.38) 50.87,12.56 arc(50.79,12.61) 50.69,12.63 26.78,12.63 arc(26.68,12.61) 26.6,12.56 26.11,12.07 arc(26.05,11.99) 26.03,11.89 26.03,6.15 arc(26.11,5.97) 26.29,5.9 26.55,5.9 arc(26.73,5.97) 26.8,6.15 C25.1
  Bottom Layer w0.254: R47.1 26.8,9.28 C25.1
$H1_1: length 5.5
  Top Layer w0.254: H1.1 62.9,23.87
  Bottom Layer w0.254: H1.1 R5.2
$H1_2: length 5.3
  Top Layer w0.254: H1.2 68.6,23.87
  Bottom Layer w0.254: H1.2 R6.1
$H2_1: length 5.4
  Top Layer w0.254: H2.1 R1.1
  Bottom Layer w0.254: H2.1 R4.2
$H2_2: length 5.6
  Top Layer w0.254: H2.2 R11.1
  Bottom Layer w0.254: H2.2 R9.1
$H3_1: length 5.5
  Top Layer w0.254: H3.1 55.37,23.87
  Bottom Layer w0.254: H3.1 R10.2
$H3_2: length 5.4
  Top Layer w0.254: H3.2 61.07,23.87
  Bottom Layer w0.254: H3.2 R2.1
$H4_1: length 5.4
  Top Layer w0.254: H4.1 R13.1
  Bottom Layer w0.254: H4.1 R16.2
$H4_2: length 5.5
  Top Layer w0.254: H4.2 R19.1
  Bottom Layer w0.254: H4.2 R17.1
$H5_1: length 5.4
  Top Layer w0.254: H5.1 47.83,23.87
  Bottom Layer w0.254: H5.1 R18.2
$H5_2: length 5.4
  Top Layer w0.254: H5.2 53.54,23.87
  Bottom Layer w0.254: H5.2 R14.1
$H6_1: length 5.5
  Top Layer w0.254: H6.1 R21.1
  Bottom Layer w0.254: H6.1 53.3,4.12
$H6_2: length 5.5
  Top Layer w0.254: H6.2 47.83,4.14
  Bottom Layer w0.254: H6.2 48.04,4.12
$H7_1: length 5.4
  Top Layer w0.254: H7.1 40.3,23.87
  Bottom Layer w0.254: H7.1 R26.2
$H7_2: length 5.5
  Top Layer w0.254: H7.2 46,23.87
  Bottom Layer w0.254: H7.2 R22.1
$H8_1: length 5.5
  Top Layer w0.254: H8.1 R29.1
  Bottom Layer w0.254: H8.1 R32.2
$H8_2: length 5.5
  Top Layer w0.254: H8.2 40.42,4.14
  Bottom Layer w0.254: H8.2 R33.1
$H9_1: length 5.3
  Top Layer w0.254: H9.1 32.77,23.87
  Bottom Layer w0.254: H9.1 R36.2
$H9_2: length 5.5
  Top Layer w0.254: H9.2 38.47,23.87
  Bottom Layer w0.254: H9.2 R30.1
$H10_1: length 5.5
  Top Layer w0.254: H10.1 R42.1
  Bottom Layer w0.254: H10.1 R43.2
$H10_2: length 5.4
  Top Layer w0.254: H10.2 R48.1
  Bottom Layer w0.254: H10.2 R46.1
$H11_1: length 21.8
  Top Layer w0.152: U1.19 49.87,17.14 arc(49.94,16.76) 50.16,16.43 v1(51.05,15.54)
  Bottom Layer w0.152: R55.1 66.04,18.09
  Bottom Layer w0.254: H11.1 63.77,15.83 arc(63.44,15.61) 63.06,15.54 v1(51.05,15.54)
$H11_3: length 3.8
  Bottom Layer w0.254: H11.3 64.73,14.25 arc(64.4,14.03) 64.01,13.95 R53.1
$H11_8: length 25.1
  Top Layer w0.152: 59.92,16.45 59.94,16.43 v2(59.94,14.76) ; v1(51.05,14.76) 49.66,16.15 arc(49.44,16.48) 49.37,16.87 49.37,18.54
  Top Layer w0.254: H11.8 67.78,11.29 arc(67.27,11.63) 66.67,11.74 65.95,11.74 arc(64.98,11.94) 64.15,12.49 62.62,14.02 arc(61.8,14.57) 60.83,14.76 v2(59.94,14.76)
  Bottom Layer w0.254: v1(51.05,14.76) v2(59.94,14.76)
$L1_1: length 18.8
  Bottom Layer w1.016: L1.1 9.46,12.72 ; 9.46,12.72 9.46,19.37 ; 9.46,12.72 U2.1
$L1_2: length 2.6
  Top Layer w0.254: R44.1 L1.2
$L1_3: length 4.8
  Bottom Layer w0.254: R45.2 30.36,9.23 L1.3 30.25,9.34 R47.2
$L1_4: length 5.1
  Bottom Layer w0.254: R41.2 30.29,2.09 L1.4 30.36,2.08 30.36,5.03
$R34_1: length 2.2
  Top Layer w0.254: R39.2 R34.1
$R34_2: length 2.2
  Top Layer w0.254: R34.2 R35.2
$R35_1: length 2.2
  Top Layer w0.254: R35.1 R40.2
$R39_1: length 28.3
  Top Layer w0.254: 4.9,3.16 7.8,6.06 arc(7.85,6.14) 7.87,6.24 7.87,8.85 arc(7.89,8.94) 7.95,9.02 8.82,9.9 arc(8.91,9.95) 9,9.97 10,9.97
  Top Layer w1.016: 4.46,19.37 1.65,16.56 1.65,6.4 4.9,3.16
$R40_1: length 2.2
  Top Layer w0.254: R40.1 R44.2
CS: length 11.5
  Top Layer w0.152: v1(51.05,16.31) 50.66,16.7 arc(50.44,17.03) 50.37,17.41 50.37,18.54 ; R50.2 R49.1 44.46,17.54 arc(44.79,17.76) 45.18,17.84 v2(45.85,17.84)
  Bottom Layer w0.152: v2(45.85,17.84) 47.08,16.6 arc(47.41,16.38) 47.8,16.31 v1(51.05,16.31)
IN6: length 23.7
  Top Layer w0.152: 66.72,22.42 66.17,22.42 arc(65.99,22.35) 65.91,22.17 65.91,21.52 arc(65.84,21.34) 65.66,21.27 59.44,21.27 arc(59.26,21.19) 59.18,21.02 59.18,12.8 arc(59.11,12.62) 58.93,12.54 U1.3
  Top Layer w0.254: C6.1 68.54,22.42 68.6,22.36
IN7: length 15.4
  Top Layer w0.152: U1.5 58.17,13.54 arc(58.35,13.62) 58.42,13.8 58.42,22.17 arc(58.49,22.35) 58.67,22.42 59.19,22.42
  Top Layer w0.254: 61.07,22.36 61.01,22.42 C2.1
IP6: length 22.7
  Top Layer w0.152: U1.4 58.55,13.04 arc(58.73,13.12) 58.8,13.3 58.8,21.4 arc(58.88,21.58) 59.06,21.65 65.28,21.65 arc(65.46,21.72) 65.53,21.9 65.53,22.15 arc(65.46,22.33) 65.28,22.41 C5.2
  Top Layer w0.254: C5.2 64.73,22.36 62.9,22.36
IP7: length 14.5
  Top Layer w0.152: 57.25,22.41 57.78,22.41 arc(57.96,22.33) 58.04,22.15 58.04,14.3 arc(57.96,14.12) 57.78,14.04 U1.6
  Top Layer w0.254: 55.37,22.36 57.2,22.36 C4.2
NRST: length 4.6
  Top Layer w0.152: U1.15 51.87,16.75 v1(51.82,16.7)
  Bottom Layer w0.152: v1(51.82,16.7) 51.86,16.75 R54.2 54.49,16.75 54.54,16.79
SCLK: length 15.7
  Top Layer w0.152: v1(51.05,13.95) 49.16,15.84 arc(48.94,16.17) 48.87,16.56 U1.21
  Bottom Layer w0.254: R53.2 v1(51.05,13.95)
SEL: length 1.8
  Top Layer w0.152: U1.36 45.31,10.99 R52.1

## Copper pours and planes (outline as drawn; the poured copper is in the pictures)
GND on Top Layer: 24.02,26.74 24.04,26.91 24.09,27.11 24.18,27.29 24.31,27.44 24.47,27.57 24.65,27.67 24.84,27.72 25.02,27.74 69.72,27.74 69.9,27.72 70.09,27.67 70.27,27.57 70.43,27.44 70.56,27.29 70.65,27.11 70.71,26.91 70.72,26.74 70.72,1.32 70.71,1.15 70.65,0.95 70.56,0.77 70.43,0.62 70.27,0.49 70.09,0.39 69.9,0.34 69.72,0.32 25.02,0.32 24.84,0.34 24.65,0.39 24.47,0.49 24.31,0.62 24.18,0.77 24.09,0.95 24.04,1.15 24.02,1.32
GND on Bottom Layer: 24,26.71 24.02,26.88 24.07,27.08 24.17,27.26 24.3,27.41 24.45,27.54 24.63,27.64 24.83,27.69 25,27.71 69.71,27.71 69.88,27.69 70.08,27.64 70.26,27.54 70.41,27.41 70.54,27.26 70.64,27.08 70.69,26.88 70.71,26.71 70.71,1.29 70.69,1.12 70.64,0.92 70.54,0.74 70.41,0.59 70.26,0.46 70.08,0.36 69.88,0.31 69.71,0.29 25,0.29 24.83,0.31 24.63,0.36 24.45,0.46 24.3,0.59 24.17,0.74 24.07,0.92 24.02,1.12 24,1.29

## Text on the board
Bottom Silkscreen Layer: SCLK | NyaSensei / ESP-01S&BL0910 / 10Ch Power Meter / Rev. 1.3 241031
Top Silkscreen Layer: 1 / CS / 0 | SEL | CH.10 | CH.1 | CH.9 | CH.2 | CH.8 | CH.3 | CH.4 | CH.7 | CH.5 | CH.6
